# EAGLE schematic power electronics2 (EAGLE 9.2.2)
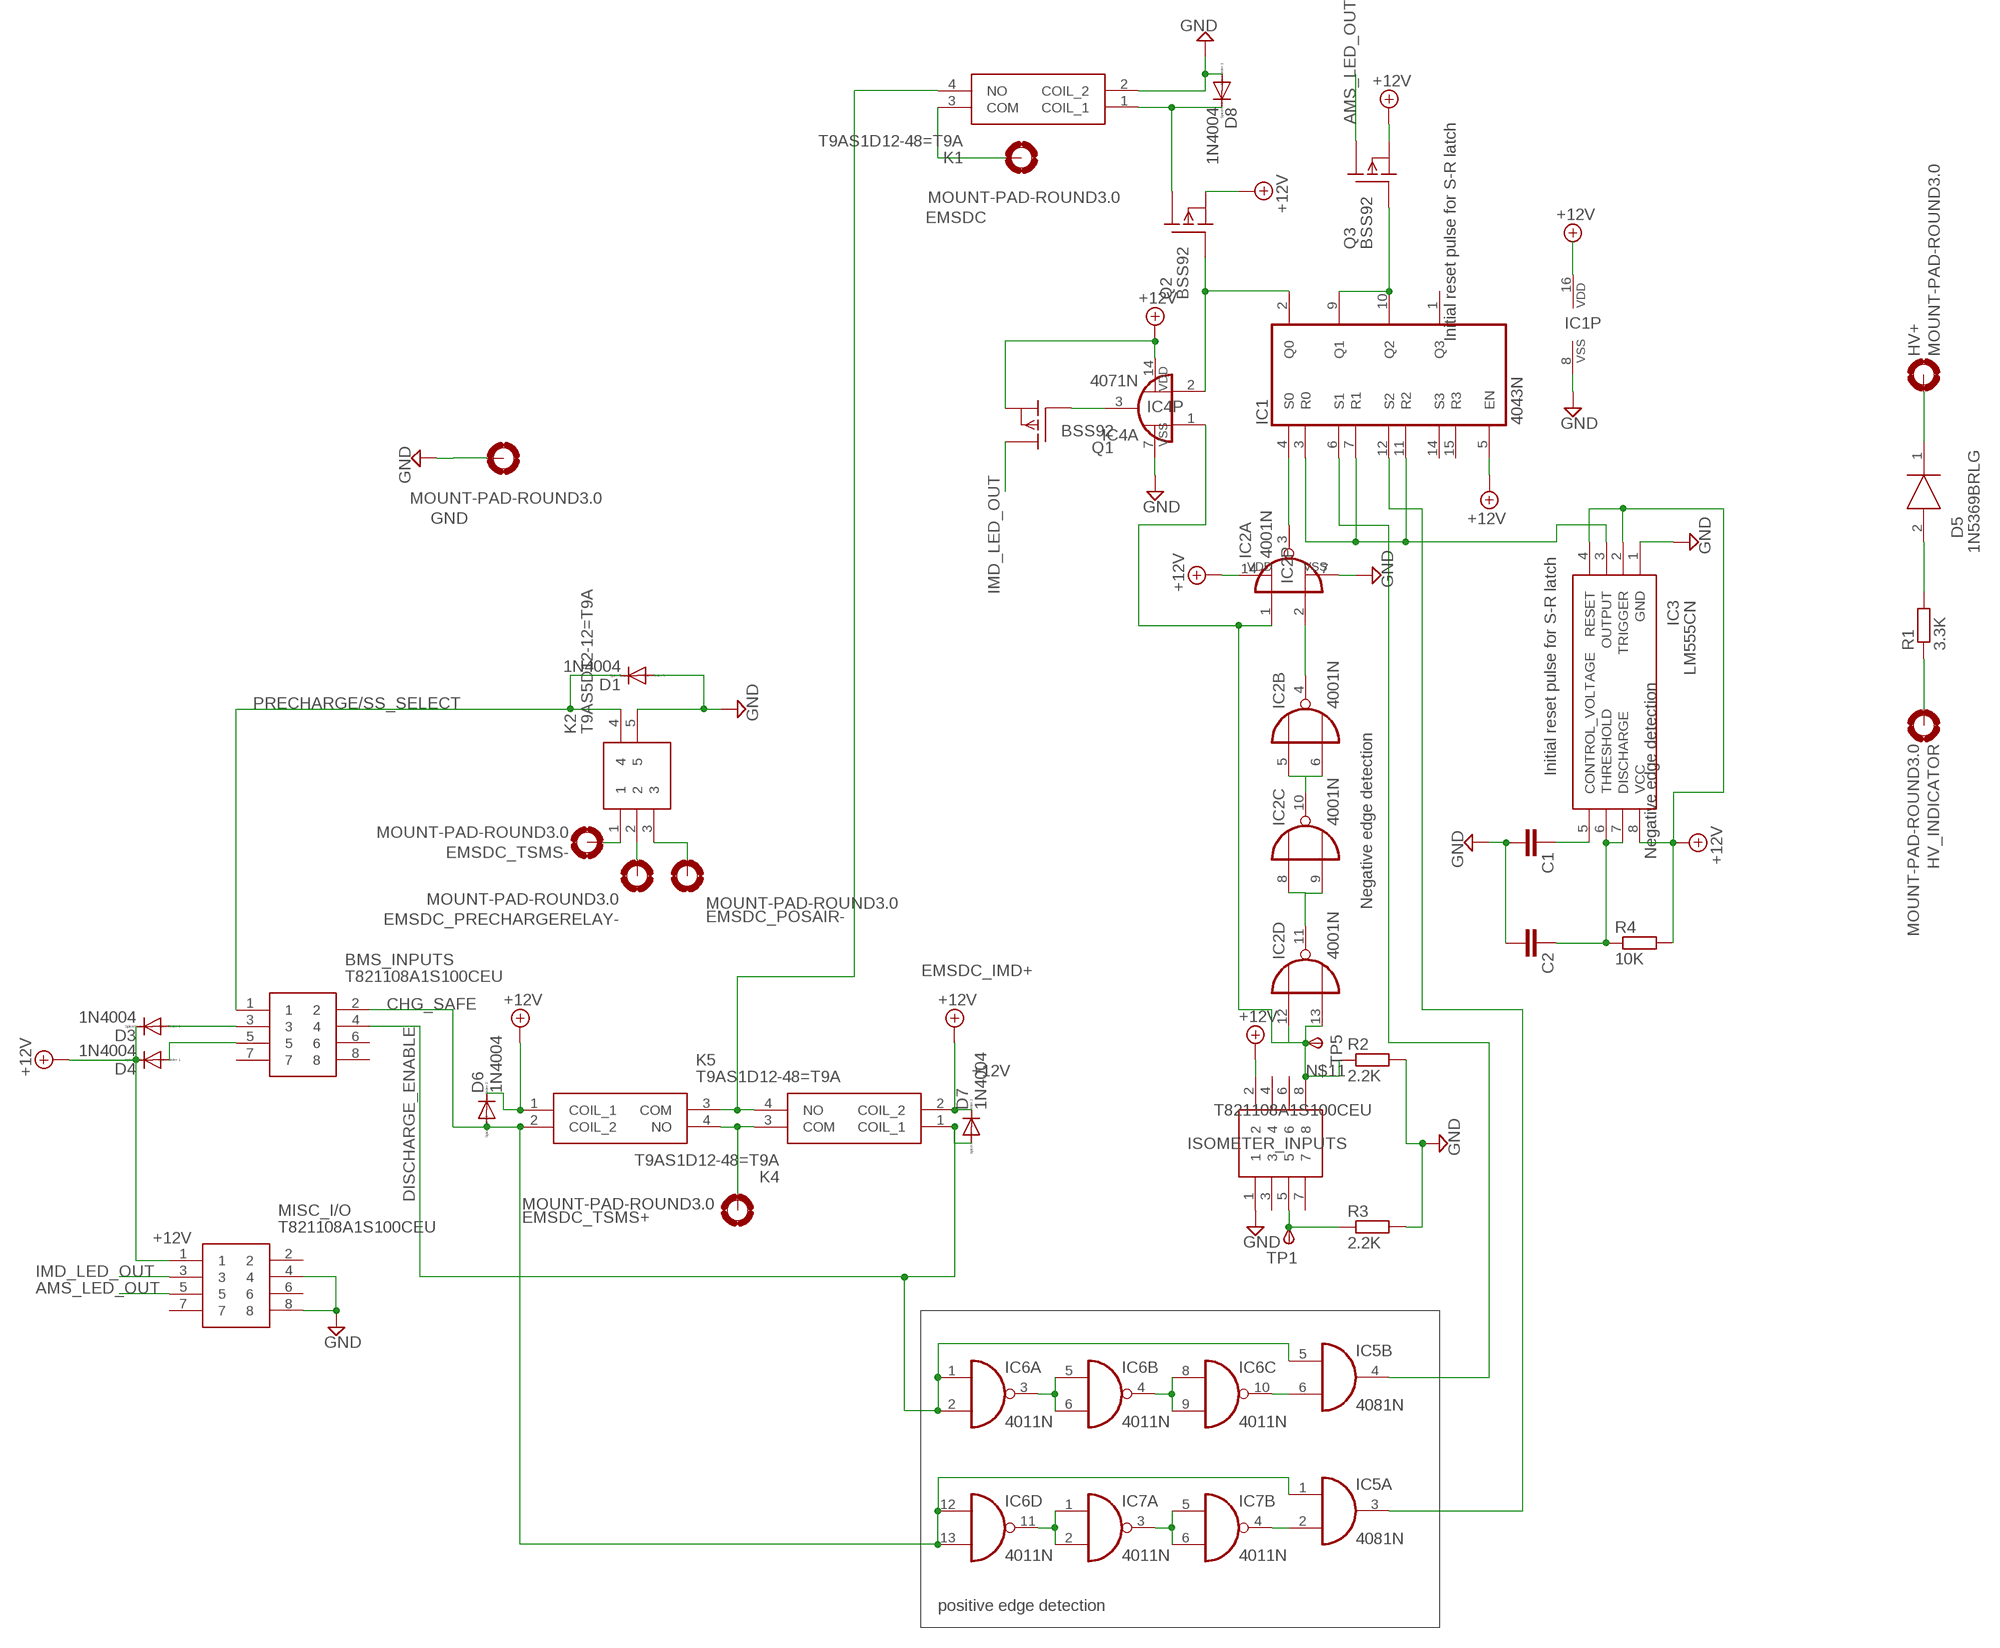
[diagram p0: schematic, sheet 1]

## Parts
BMS_INPUTS  T821108A1S100CEU  [HDRV8W64P254_2X4_1778X895X915P]
C1  C-EU050-024X044  [C050-024X044]
C2  C-EU050-024X044  [C050-024X044]
D1  1N4004  [DO41-10]
D3  1N4004  [DO41-10]
D4  1N4004  [DO41-10]
D5  1N5369BRLG  [DIOAD2260W109L864D349]
D6  1N4004  [DO41-10]
D7  1N4004  [DO41-10]
D8  1N4004  [DO41-10]
EMSDC  MOUNT-PAD-ROUND3.0  [3,0-PAD]
EMSDC_POSAIR-  MOUNT-PAD-ROUND3.0  [3,0-PAD]
EMSDC_PRECHARGERELAY-  MOUNT-PAD-ROUND3.0  [3,0-PAD]
EMSDC_TSMS+  MOUNT-PAD-ROUND3.0  [3,0-PAD]
EMSDC_TSMS-  MOUNT-PAD-ROUND3.0  [3,0-PAD]
GND  MOUNT-PAD-ROUND3.0  [3,0-PAD]
HV+  MOUNT-PAD-ROUND3.0  [3,0-PAD]
HV_INDICATOR  MOUNT-PAD-ROUND3.0  [3,0-PAD]
IC1  4043N  [DIL16]
IC2  4001N  [DIL14]
IC3  LM555CN  [DIP762W53P254L980H533Q8N]
IC4  4071N  [DIL14]
IC5  4081N  [DIL14]
IC6  4011N  [DIL14]
IC7  4011N  [DIL14]
ISOMETER_INPUTS  T821108A1S100CEU  [HDRV8W64P254_2X4_1778X895X915P]
K1  T9AS1D12-48=T9A  [T9AS1D1248T9A]
K2  T9AS5D12-12=T9A  [T9AS1D12]
K4  T9AS1D12-48=T9A  [T9AS1D1248T9A]
K5  T9AS1D12-48=T9A  [T9AS1D1248T9A]
MISC_I/O  T821108A1S100CEU  [HDRV8W64P254_2X4_1778X895X915P]
Q1  BSS92  [TO92]
Q2  BSS92  [TO92]
Q3  BSS92  [TO92]
R1  3.3K  R-EU_0207/15  [0207/15]
R2  2.2K  R-EU_0207/12  [0207/12]
R3  2.2K  R-EU_0207/12  [0207/12]
R4  10K  R-EU_0207/15  [0207/15]
TP1  TPSPAD1-17  [P1-17]
TP5  TPSPAD1-17  [P1-17]

## Nets
+12V: D3.C D4.C D6.C D7.C IC1.5(EN) IC1.16(VDD) IC2.14(P:VDD) IC3.2(TRIGGER) IC3.4(RESET) IC3.8(VCC) IC4.14(P:VDD) ISOMETER_INPUTS.2 K4.2(COIL_2) K5.1(COIL_1) MISC_I/O.1 Q1.3(S) Q2.3(S) Q3.3(S) R4.2
AMS_LED_OUT: MISC_I/O.5 Q3.2(D)
CHG_SAFE: BMS_INPUTS.2 D6.A IC5.1(A:I0) IC6.12(D:I0) IC6.13(D:I1) K5.2(COIL_2)
DISCHARGE_ENABLE: BMS_INPUTS.4 D7.A IC5.5(B:I0) IC6.1(A:I0) IC6.2(A:I1) K4.1(COIL_1)
EMSDC_IMD+: K1.4(NO) K4.4(NO) K5.3(COM)
GND: C1.2 C2.2 D1.A D8.A GND.B3,0(MOUNT) IC1.8(VSS) IC2.7(P:VSS) IC3.1(GND) IC4.7(P:VSS) ISOMETER_INPUTS.1 K1.2(COIL_2) K2.5 MISC_I/O.4 MISC_I/O.8 R2.2 R3.2
IMD_LED_OUT: MISC_I/O.3 Q1.2(D)
N$1: EMSDC_TSMS-.B3,0(MOUNT) K2.1
N$2: EMSDC_POSAIR-.B3,0(MOUNT) K2.3
N$3: EMSDC_PRECHARGERELAY-.B3,0(MOUNT) K2.2
N$4: EMSDC_TSMS+.B3,0(MOUNT) K4.3(COM) K5.4(NO)
N$5: D5.1(K) HV+.B3,0(MOUNT)
N$6: BMS_INPUTS.3 D3.A
N$7: D5.2(A) R1.2
N$8: BMS_INPUTS.5 D4.A
N$9: HV_INDICATOR.B3,0(MOUNT) R1.1
N$10: ISOMETER_INPUTS.5 R3.1 TP1.TP(PP)
N$11: IC2.1(A:I0) IC2.12(D:I0) IC2.13(D:I1) IC4.1(A:I0) ISOMETER_INPUTS.8 R2.1 TP5.TP(PP)
N$12: IC2.8(C:I0) IC2.9(C:I1) IC2.11(D:O)
N$13: IC2.5(B:I0) IC2.6(B:I1) IC2.10(C:O)
N$14: IC2.2(A:I1) IC2.4(B:O)
N$15: D8.C K1.1(COIL_1) Q2.2(D)
N$16: EMSDC.B3,0(MOUNT) K1.3(COM)
N$17: IC1.4(S0) IC2.3(A:O)
N$18: C2.1 IC3.6(THRESHOLD) IC3.7(DISCHARGE) R4.1
N$19: C1.1 IC3.5(CONTROL_VOLTAGE)
N$20: IC1.3(R0) IC1.7(R1) IC1.11(R2) IC3.3(OUTPUT)
N$21: IC1.2(Q0) IC4.2(A:I1) Q2.1(G)
N$22: IC4.3(A:O) Q1.1(G)
N$23: IC1.6(S1) IC5.4(B:O)
N$24: IC6.3(A:O) IC6.5(B:I0) IC6.6(B:I1)
N$25: IC6.4(B:O) IC6.8(C:I0) IC6.9(C:I1)
N$26: IC5.6(B:I1) IC6.10(C:O)
N$27: IC1.12(S2) IC5.3(A:O)
N$28: IC5.2(A:I1) IC7.4(B:O)
N$29: IC1.9(Q1) IC1.10(Q2) Q3.1(G)
N$30: IC7.3(A:O) IC7.5(B:I0) IC7.6(B:I1)
N$32: IC6.11(D:O) IC7.1(A:I0) IC7.2(A:I1)
PRECHARGE/SS_SELECT: BMS_INPUTS.1 D1.C K2.4
Unconnected: BMS_INPUTS.6 BMS_INPUTS.7 BMS_INPUTS.8 IC1.1(Q3) IC1.14(S3) IC1.15(R3) IC4.4(B:O) IC4.5(B:I0) IC4.6(B:I1) IC4.8(C:I0) IC4.9(C:I1) IC4.10(C:O) IC4.11(D:O) IC4.12(D:I0) IC4.13(D:I1) IC5.8(C:I0) IC5.9(C:I1) IC5.10(C:O) IC5.11(D:O) IC5.12(D:I0) IC5.13(D:I1) IC7.8(C:I0) IC7.9(C:I1) IC7.10(C:O) IC7.11(D:O) IC7.12(D:I0) IC7.13(D:I1) ISOMETER_INPUTS.3 ISOMETER_INPUTS.4 ISOMETER_INPUTS.6 ISOMETER_INPUTS.7 MISC_I/O.2 MISC_I/O.6 MISC_I/O.7

## Notes on the sheet
- Initial reset pulse for S-R latch
- Initial reset pulse for S-R latch
- Negative edge detection
- Negative edge detection
- positive edge detection

## Power pins joined to a net without a drawn wire
VDD: IC5.14(P:VDD) IC6.14(P:VDD) IC7.14(P:VDD)
VSS: IC5.7(P:VSS) IC6.7(P:VSS) IC7.7(P:VSS)

## Library data of the parts
BMS_INPUTS ISOMETER_INPUTS MISC_I/O = SamacSys_Parts:T821108A1S100CEU: HEADER, VERTICAL, 2.54MM, 8WAY Amphenol T821 Series, 2.54mm Pitch 8 Way 2 Row Straight PCB Header, Solder Termination, 3A Source: Datasheet <http://uk.rs-online.com/web/p/products/8323569>; DESCRIPTION: HEADER, VERTICAL, 2.54MM, 8WAY Amphenol T821 Series, 2.54mm Pitch 8 Way 2 Row Straight PCB Header, Solder Termination, 3A; HEIGHT: 9.15mm; MANUFACTURER_NAME: Amphenol; MANUFACTURER_PART_NUMBER: T821108A1S100CEU; RS_PART_NUMBER: 8323569; RS_PRICE-STOCK: http://uk.rs-online.com/web/p/products/8323569
C1 C2 = rcl:C-EU: CAPACITOR, European symbol; SPICEPREFIX: C
D1 D3 D4 D6-D8 = diode:1N4004: DIODE general purpose rectifier, 1 A
D5 = SamacSys_Parts:1N5369BRLG: Zener Diode, 51V 5% 5 W Through Hole 2-pin DO-15 Source: Datasheet <http://uk.rs-online.com/web/p/products/6547678P>; ALLIED_NUMBER: 70339233; DESCRIPTION: Zener Diode, 51V 5% 5 W Through Hole 2-pin DO-15; HEIGHT: mm; MANUFACTURER_NAME: ON Semiconductor; MANUFACTURER_PART_NUMBER: 1N5369BRLG; RS_PART_NUMBER: 6547678P; RS_PRICE-STOCK: http://uk.rs-online.com/web/p/products/6547678P
EMSDC EMSDC_POSAIR- EMSDC_PRECHARGERELAY- EMSDC_TSMS+ EMSDC_TSMS- GND HV+ HV_INDICATOR = holes:MOUNT-PAD-ROUND: MOUNTING PAD, round
IC1 = 40xx:4043: Quad 3-state NOR R/S LATCH
IC2 = 40xx:4001: Quad 2-input NOR
IC3 = SamacSys_Parts:LM555CN: ON Semiconductor LM555CN, Timer, 4.5 16 V, 8-Pin PDIP Source: Datasheet <https://www.mouser.com/datasheet/2/308/LM555-1124984.pdf>; DESCRIPTION: ON Semiconductor LM555CN, Timer, 4.5 16 V, 8-Pin PDIP; HEIGHT: 5.33mm; MANUFACTURER_NAME: ON Semiconductor; MANUFACTURER_PART_NUMBER: LM555CN; MOUSER_PART_NUMBER: 512-LM555CN
IC4 = 40xx:4071: Quad 2-input OR
IC5 = 40xx:4081: Quad 2-input AND
IC6 IC7 = 40xx:4011: Quad 2-input NAND
K1 K4 K5 = SamacSys_Parts:T9AS1D12-48=T9A: SPST-NO PCB Mount Non-Latching Relay Through Hole, 48V dc Source: Datasheet <http://uk.rs-online.com/web/p/products/6802534P>; DESCRIPTION: SPST-NO PCB Mount Non-Latching Relay Through Hole, 48V dc; HEIGHT: 20.4mm; MANUFACTURER_NAME: TE Connectivity; MANUFACTURER_PART_NUMBER: T9AS1D12-48=T9A; RS_PART_NUMBER: 6802534P; RS_PRICE-STOCK: http://uk.rs-online.com/web/p/products/6802534P
K2 = SamacSys_Parts:T9AS5D12-12=T9A: PCB Relay SPDT 30A 12Vdc,thru hole SPDT PCB Mount Non-Latching Relay Through Hole, 12V dc Source: Datasheet; ALLIED_NUMBER: R1111589; DESCRIPTION: PCB Relay SPDT 30A 12Vdc,thru hole SPDT PCB Mount Non-Latching Relay Through Hole, 12V dc; HEIGHT: mm; MANUFACTURER_NAME: TE Connectivity; MANUFACTURER_PART_NUMBER: T9AS5D12-12=T9A; RS_PART_NUMBER: 6802528; RS_PRICE-STOCK: https://uk.rs-online.com/web/p/products/6802528
Q1-Q3 = transistor-fet:BSS92: P-Channel Enhancement MOSFET -200V; -0,15A; 11Ohm
R1-R4 = rcl:R-EU_: RESISTOR, European symbol; SPICEPREFIX: R
TP1 TP5 = testpad:TPS: TEST PIN